# EAGLE design burnin (EAGLE 9.5.2)
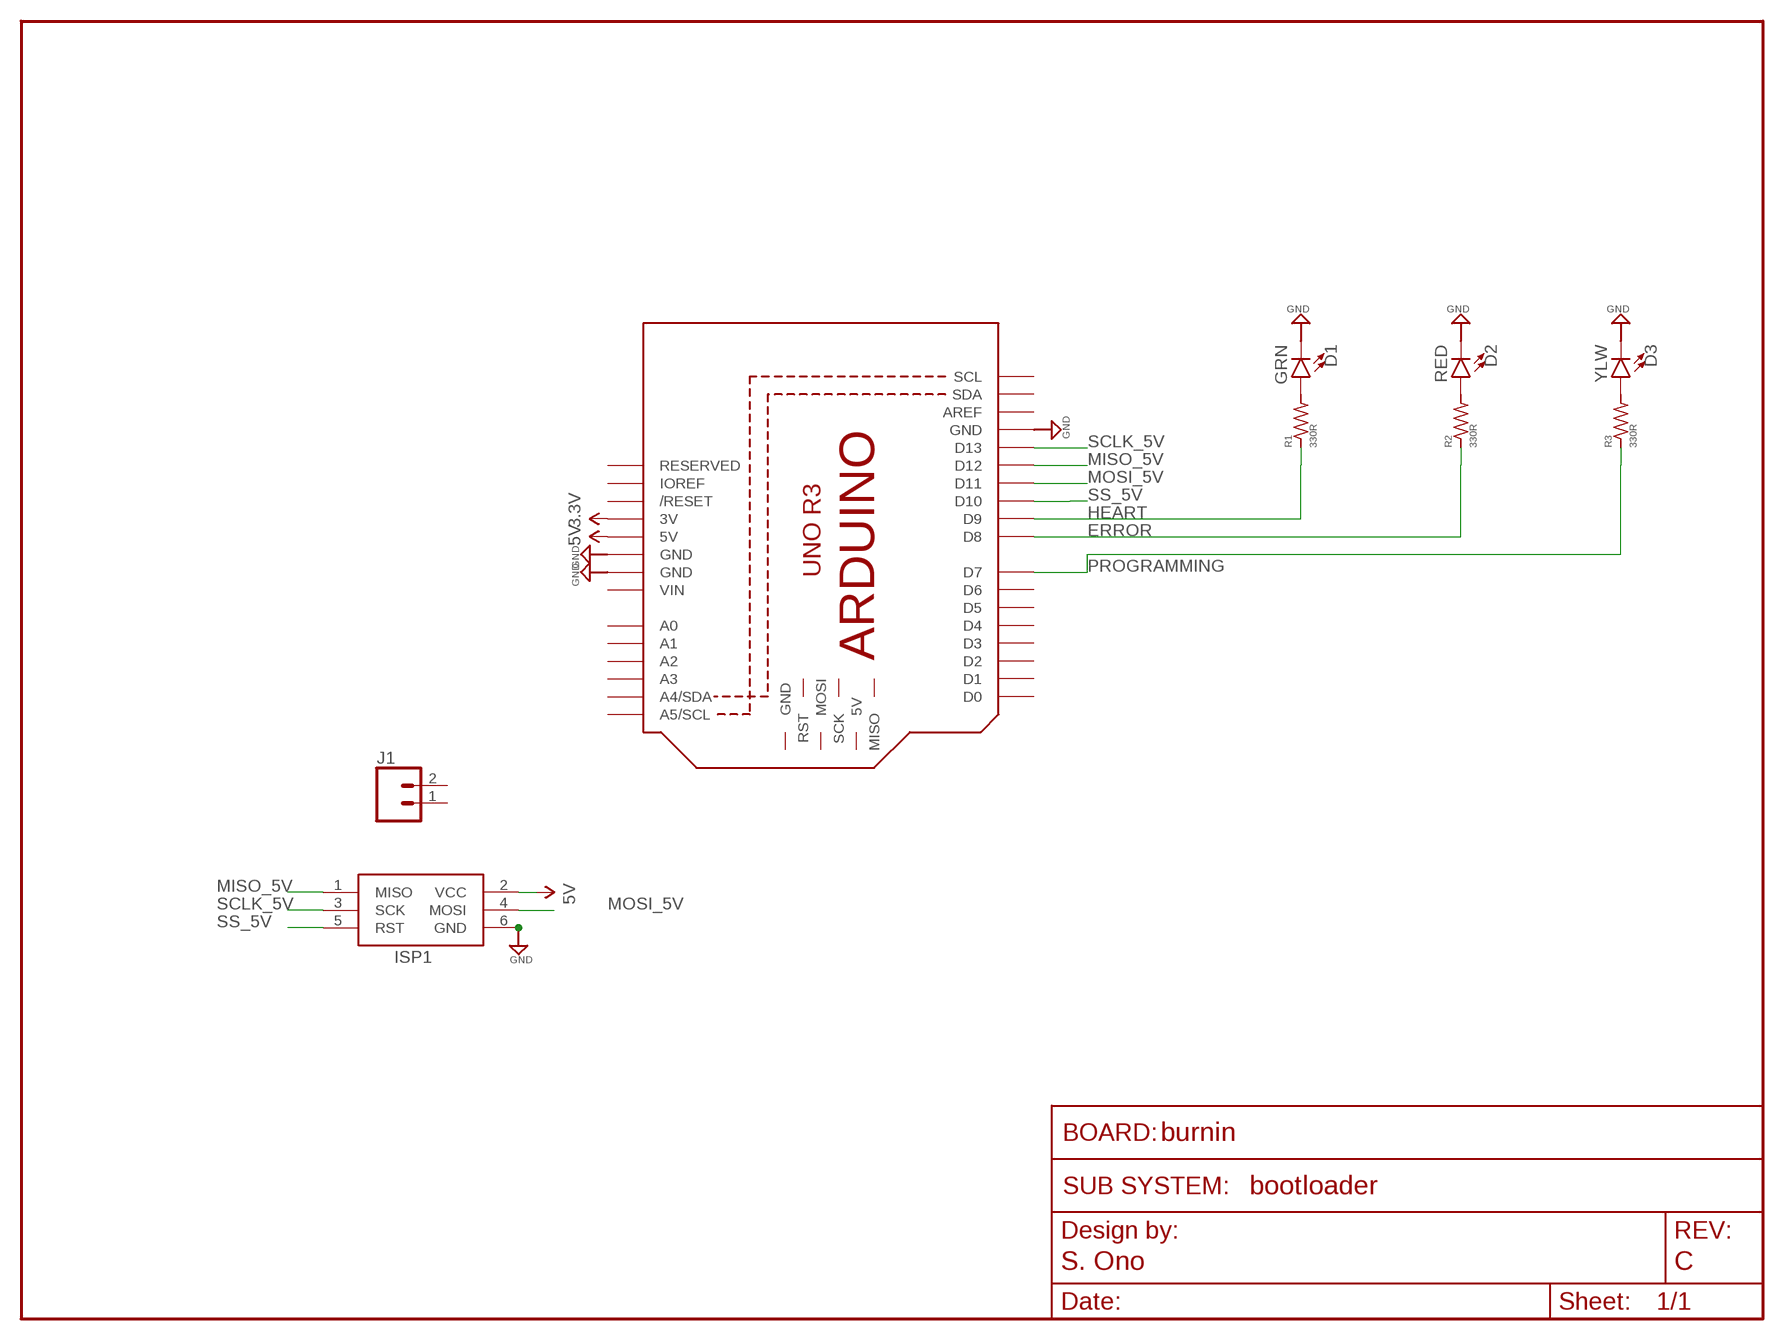
[diagram p0: schematic, sheet 1]
FRAME1 (FRAME_SCHEMATIC): AUTHOR: S. Ono; REV: C; SUBSYSTEM_NAME: bootloader

## Parts
D1  GRN  LED0603  [LED-0603]
D2  RED  LED0603  [LED-0603]
D3  YLW  LED0603  [LED-0603]
ISP1  AVRISP-6  [AVRISP]
J1  CONN_02  [1X02]
M1  ARDUINO_R3_ICSP_NODIM  [ARDUINOR3_ICSP_NODIM]
R1  330R  R-US_0603  [0603-RES]
R2  330R  R-US_0603  [0603-RES]
R3  330R  R-US_0603  [0603-RES]

## Nets
3.3V: M1.3V
5V: ISP1.2(VCC) M1.5V
ERROR: M1.D8 R2.1
GND: D1.C D2.C D3.C ISP1.6(GND) M1.GND M1.GND@1(GND) M1.GND@3(GND)
HEART: M1.D9 R1.1
MISO_5V: ISP1.1(MISO) M1.D12
MOSI_5V: ISP1.4(MOSI) M1.D11
N$1: D1.A R1.2
N$2: D2.A R2.2
N$3: D3.A R3.2
PROGRAMMING: M1.D7 R3.1
SCLK_5V: ISP1.3(SCK) M1.D13
SS_5V: ISP1.5(RST) M1.D10
Unconnected: J1.1 J1.2 M1.5V_ICSP(5V) M1.A0 M1.A1 M1.A2 M1.A3 M1.A4(A4/SDA) M1.A5(A5/SCL) M1.AREF M1.D0 M1.D1 M1.D2 M1.D3 M1.D4 M1.D5 M1.D6 M1.GND@2(GND) M1.IOREF M1.MISO M1.MOSI M1.RESERVED M1.RESET(/RESET) M1.RESET_ICSP(RST) M1.SCK M1.SCL M1.SDA

## Power pins joined to a net without a drawn wire
VIN: M1.VIN

## Library data of the parts
D1-D3 = scono:LED: https://www.digikey.com/products/en/optoelectronics/led-indication-discrete/105?k=&pkeyword=&pv7=2&pv1989=0&pv16=5&FV=ffe00069&quantity=0&ColumnSort=0&page=1&pageSize=25
ISP1 = scono:AVRISP: AVR ISP HEADER Standard 6 pin header for AVR programming
J1 = scono:CONN_02: Multi connection point. Often used as Generic Header-pin footprint for 0.1 inch spaced/style header connections On any of the 0.1 inch spaced packages, you can populate with these: Break Away Headers - Straight <https://www.sparkfun.com/products/116> (PRT-00116) Break Away Male Headers - Right Angle <https://www.sparkfun.com/products/553> (PRT-00553) Female Headers <https://www.sparkfun.com/products/115> (PRT-00115) Break Away Headers - Machine Pin <https://www.sparkfun.com/products/117> (PRT-00117) Break Away Female Headers - Swiss Machine Pin <https://www.sparkfun.com/products/743> (PRT-00743) For SCREWTERMINALS and SPRING TERMINALS visit here: Screw Terimnals on SparkFun.com <https://www.sparkfun.com/search/results?term=Screw+Terminals> (5mm/3.5mm/2.54mm spacing) This device is also useful as a general connection point to wire up your design to another part of your project. Our various solder wires solder well into these plated through hole pads. Hook-Up Wire - Assortment (Stranded, 22 AWG) <https://www.sparkfun.com/products/11375> (PRT-11375) Hook-Up Wire - Assortment (Solid Core, 22 AWG) <https://www.sparkfun.com/products/11367> (PRT-11367) View the entire wire category on our website here <https://www.sparkfun.com/categories/141> Special notes: Molex polarized connector foot print use with: PRT-08233 with associated crimp pins and housings. 2.54_SCREWTERM for use with PRT-10571. 3.5mm Screw Terminal footprints for PRT-08084 5mm Screw Terminal footprints for use with PRT-08432
M1 = scono:ARDUINO_R3_ICSP
R1-R3 = scono:R-US_: RESISTOR, American symbol

## Board
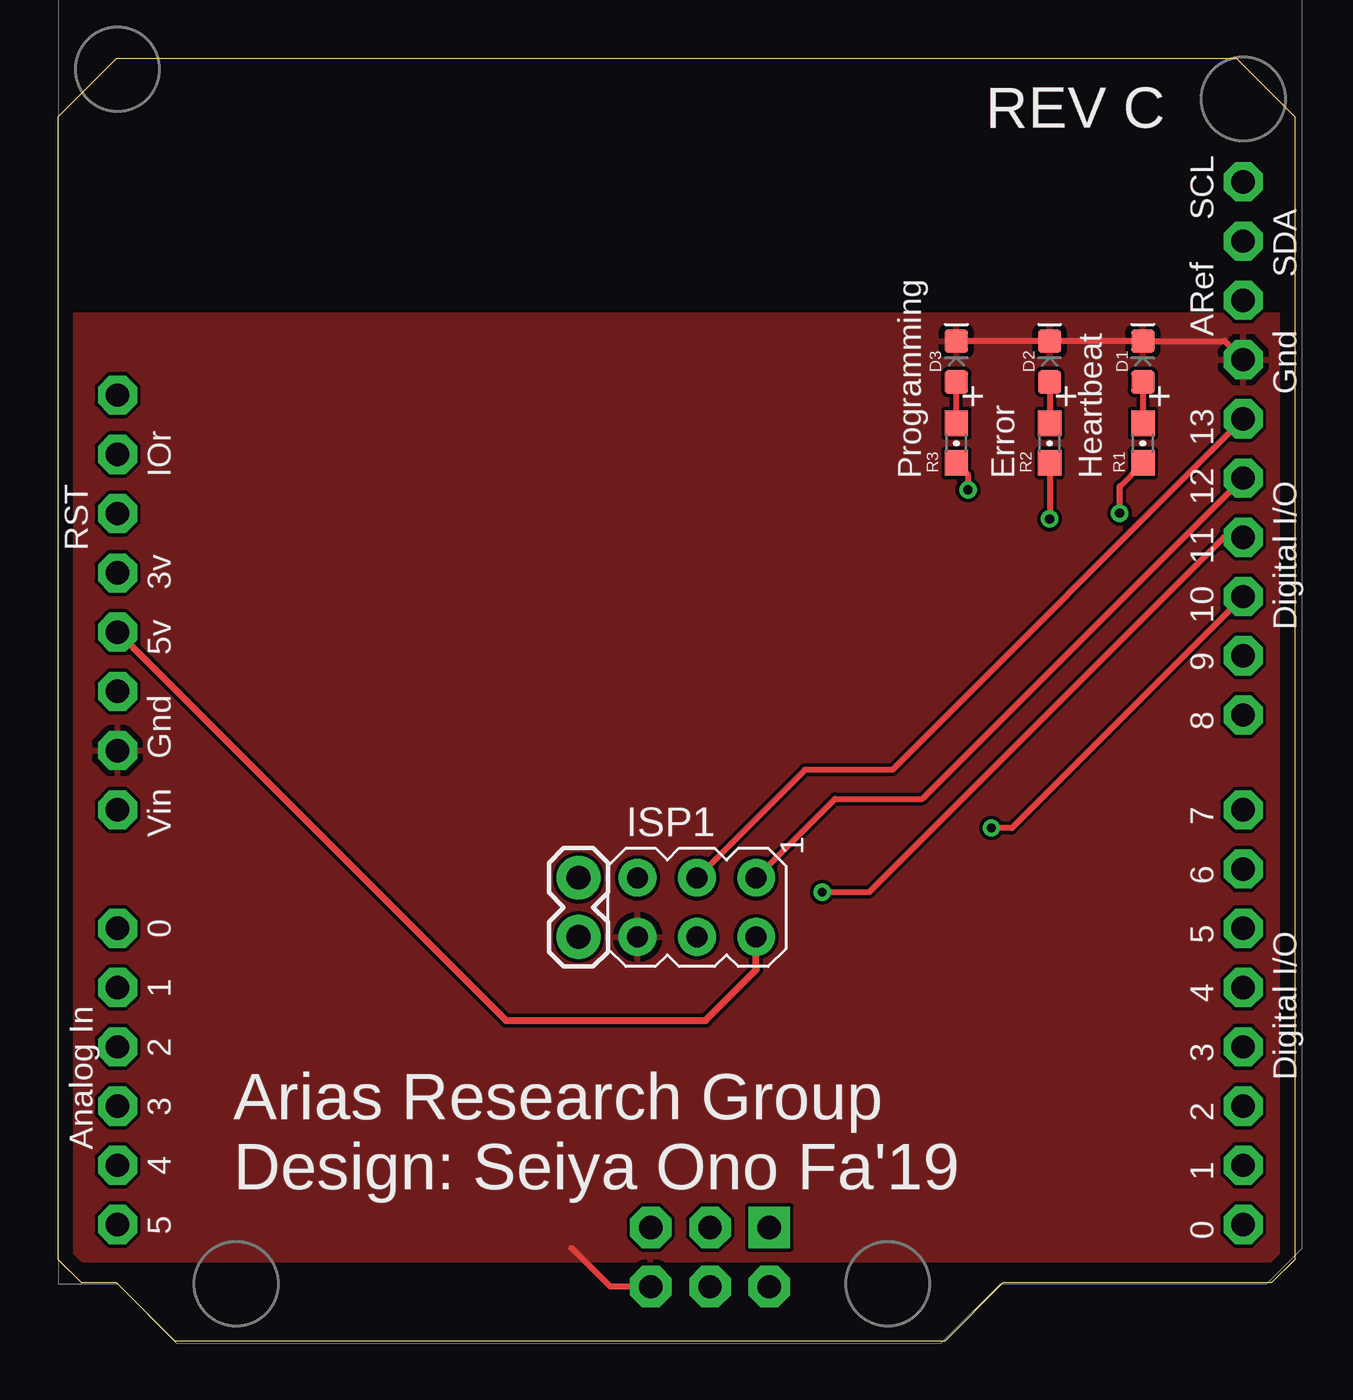
[diagram p1: board, top side]
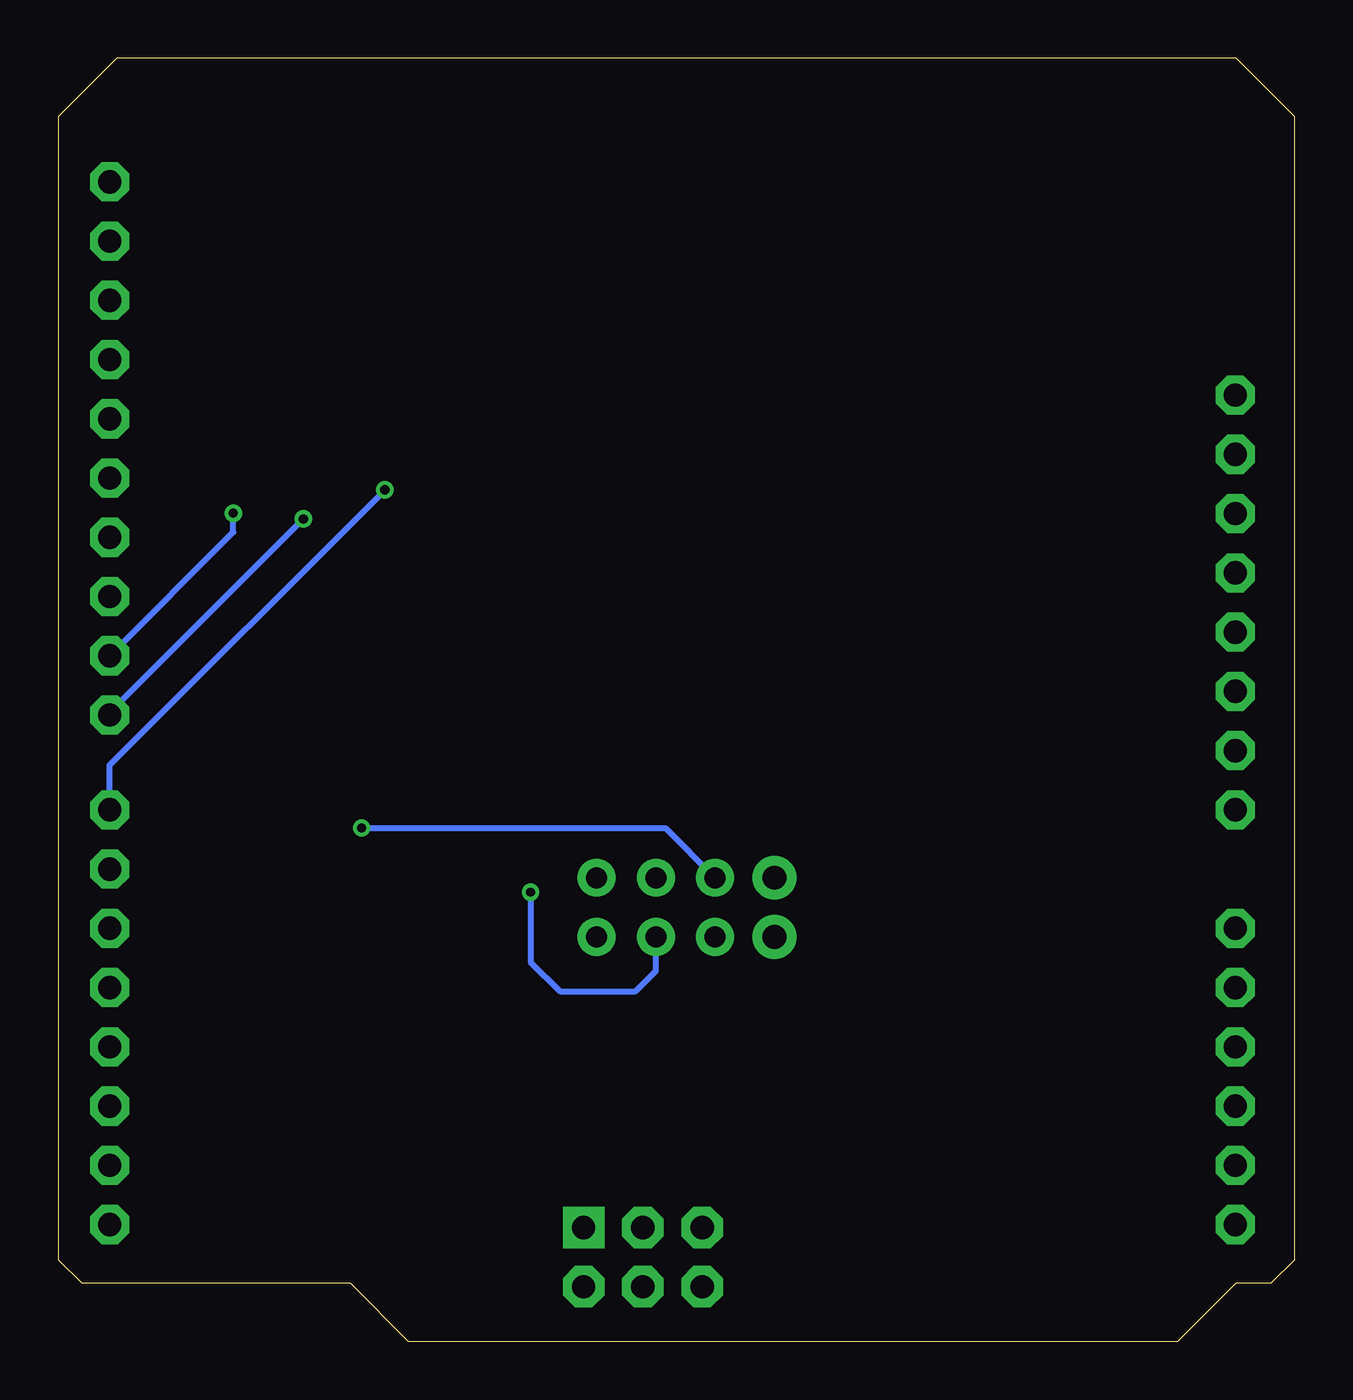
[diagram p2: board, bottom side, seen from below]

Size 53 x 55 mm. Coordinates in mm from the lower left corner, seen from the top.
Outline: 1,2.5 2.5,2.5 5,0 38,0 40.5,2.5 52,2.5 53,3.5 53,52.5 50.5,55 4,55 2.5,55 0,52.5 0,3.5
Outline: 1,2.5 0,3.5
Outline: 0,3.5 1,2.5
Copper layers (1*16): Top 2mil / dielectric 9mil / Bottom 2mil
Design rules "scono": minimum track width 6mil, minimum drill 15mil, track to track 6mil, track to pad 6mil, pad to pad 6mil, via to via 6mil, smd to smd 6mil, copper to edge 25mil, drill to drill 7mil, minimum pad ring 7mil, minimum via ring 7mil, stop-mask expansion 3mil, vias tented up to drill 0mil, thermal gap 10mil

### Footprints (pad centres in the part's own frame; a part is rotated, then mirrored left to right if it is on the bottom)
LED-0603 = smd 1 x 1: A -0.877,0; C 0.877,0
AVRISP = drill 0.9 pad 1.626: 1 -1.27,2.54; 2 1.27,2.54; 3 -1.27,0; 4 1.27,0; 5 -1.27,-2.54; 6 1.27,-2.54
1X02 = drill 1.016 pad 1.88: 1 0,0; 2 2.54,0
ARDUINOR3_ICSP_NODIM = drill 1 pad 1.676 octagon: 3V 35.56,2.54; 5V 38.1,2.54; A0 50.8,2.54; A1 53.34,2.54; A2 55.88,2.54; A3 58.42,2.54; A4 60.96,2.54; A5 63.5,2.54; AREF 23.876,50.8; D0 63.5,50.8; D1 60.96,50.8; D2 58.42,50.8; D3 55.88,50.8; D4 53.34,50.8; D5 50.8,50.8; D6 48.26,50.8; D7 45.72,50.8; D8 41.656,50.8; D9 39.116,50.8; D10 36.576,50.8; D11 34.036,50.8; D12 31.496,50.8; D13 28.956,50.8; GND 26.416,50.8; GND@1 43.18,2.54; GND@2 40.64,2.54; IOREF 30.48,2.54; RESERVED 27.94,2.54; RESET 33.02,2.54; SCL 18.796,50.8; SDA 21.336,50.8; VIN 45.72,2.54 | drill 1 pad 1.778 octagon: 5V_ICSP 66.167,30.48; GND@3 66.167,25.4; MOSI 66.167,27.94; RESET_ICSP 63.627,25.4; SCK 63.627,27.94 | drill 1 pad 1.778 square: MISO 63.627,30.48
0603-RES = smd 1.1 x 1: 1 -0.85,0; 2 0.85,0

### Placement (x,y rotation side)
D1  46.5,42 90 top
D2  42.5,42 90 top
D3  38.5,42 90 top
ISP1  27.38,18.6 270 top
J1  22.3,17.33 90 top
M1  0,68.5 270 top
R1  46.5,38.5 90 top
R2  42.5,38.5 90 top
R3  38.5,38.5 90 top

### Tracks (layer width: path | path; a pad name or v marks a point on that pad's centre or on a via)
5V
  Top 0.3: M1.5V 19.19,13.75 27.75,13.75 29.92,15.92 ISP1.2
ERROR  (via drill 0.4)
  Top 0.256: R2.1 v42.5,35.25
  Bottom 0.256: M1.D8 50.8,26.95 v42.5,35.25
GND
  Top 0.256: M1.GND@3 23.67,2.33 22,4 | D3.C D2.C D1.C 50.01,42.88 M1.GND
  pour Top: 0.5,44 53,44 53,3.5 0.5,3.5
HEART  (via drill 0.4)
  Top 0.256: v45.5,35.5 45.5,36.65 R1.1
  Bottom 0.256: M1.D9 45.5,34.68 v45.5,35.5
MISO_5V
  Top 0.256: ISP1.1 33.3,23.25 37.05,23.25 M1.D12
MOSI_5V  (via drill 0.38)
  Top 0.256: M1.D11 49.96,34.46 34.75,19.25 v32.75,19.25
  Bottom 0.256: v32.75,19.25 32.75,16.25 31.5,15 28.25,15 27.38,15.87 ISP1.4
N$1
  Top 0.256: D1.A R1.2
N$2
  Top 0.256: D2.A R2.2
N$3
  Top 0.256: R3.2 D3.A
PROGRAMMING  (via drill 0.4)
  Top 0.256: R3.1 39,37.15 v39,36.5
  Bottom 0.256: M1.D7 50.8,24.7 v39,36.5
SCLK_5V
  Top 0.256: ISP1.3 32.01,24.5 35.76,24.5 M1.D13
SS_5V  (via drill 0.38)
  Top 0.256: v40,22 40.88,22 M1.D10
  Bottom 0.256: v40,22 26.97,22 ISP1.5

### Text on the board
tPlace: REV C | Programming | Error | Heartbeat | Arias Research Group / Design: Seiya Ono Fa'19
tStop: ATMEL AVR / Burn In Shield